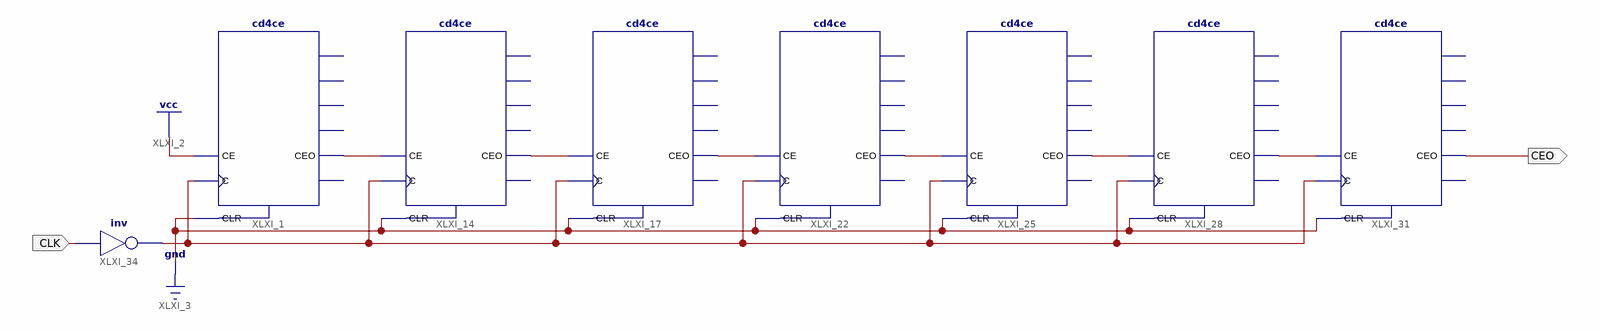
[diagram p0: schematic sheet 1]
// Xilinx ISE schematic clkdiv10M.sch (spartan6) as structural Verilog: 8 symbols, 2 ports
module clkdiv10M (
  input  CLK,
  output CEO
);

  wire CLK_I, XLXN_14, XLXN_27, XLXN_37, XLXN_44, XLXN_51, XLXN_56;

  cd4ce XLXI_1 (.C(CLK_I), .CE(1'b1), .CLR(1'b0), .CEO(XLXN_14));  // open: Q0, Q1, Q2, Q3, TC
  cd4ce XLXI_14 (.C(CLK_I), .CE(XLXN_14), .CLR(1'b0), .CEO(XLXN_27));  // open: Q0, Q1, Q2, Q3, TC
  cd4ce XLXI_17 (.C(CLK_I), .CE(XLXN_27), .CLR(1'b0), .CEO(XLXN_37));  // open: Q0, Q1, Q2, Q3, TC
  cd4ce XLXI_22 (.C(CLK_I), .CE(XLXN_37), .CLR(1'b0), .CEO(XLXN_44));  // open: Q0, Q1, Q2, Q3, TC
  cd4ce XLXI_25 (.C(CLK_I), .CE(XLXN_44), .CLR(1'b0), .CEO(XLXN_51));  // open: Q0, Q1, Q2, Q3, TC
  cd4ce XLXI_28 (.C(CLK_I), .CE(XLXN_51), .CLR(1'b0), .CEO(XLXN_56));  // open: Q0, Q1, Q2, Q3, TC
  cd4ce XLXI_31 (.C(CLK_I), .CE(XLXN_56), .CLR(1'b0), .CEO(CEO));  // open: Q0, Q1, Q2, Q3, TC
  not XLXI_34 (CLK_I, CLK);
endmodule
